# Altium schematic sheet power supply.SchDoc
size A
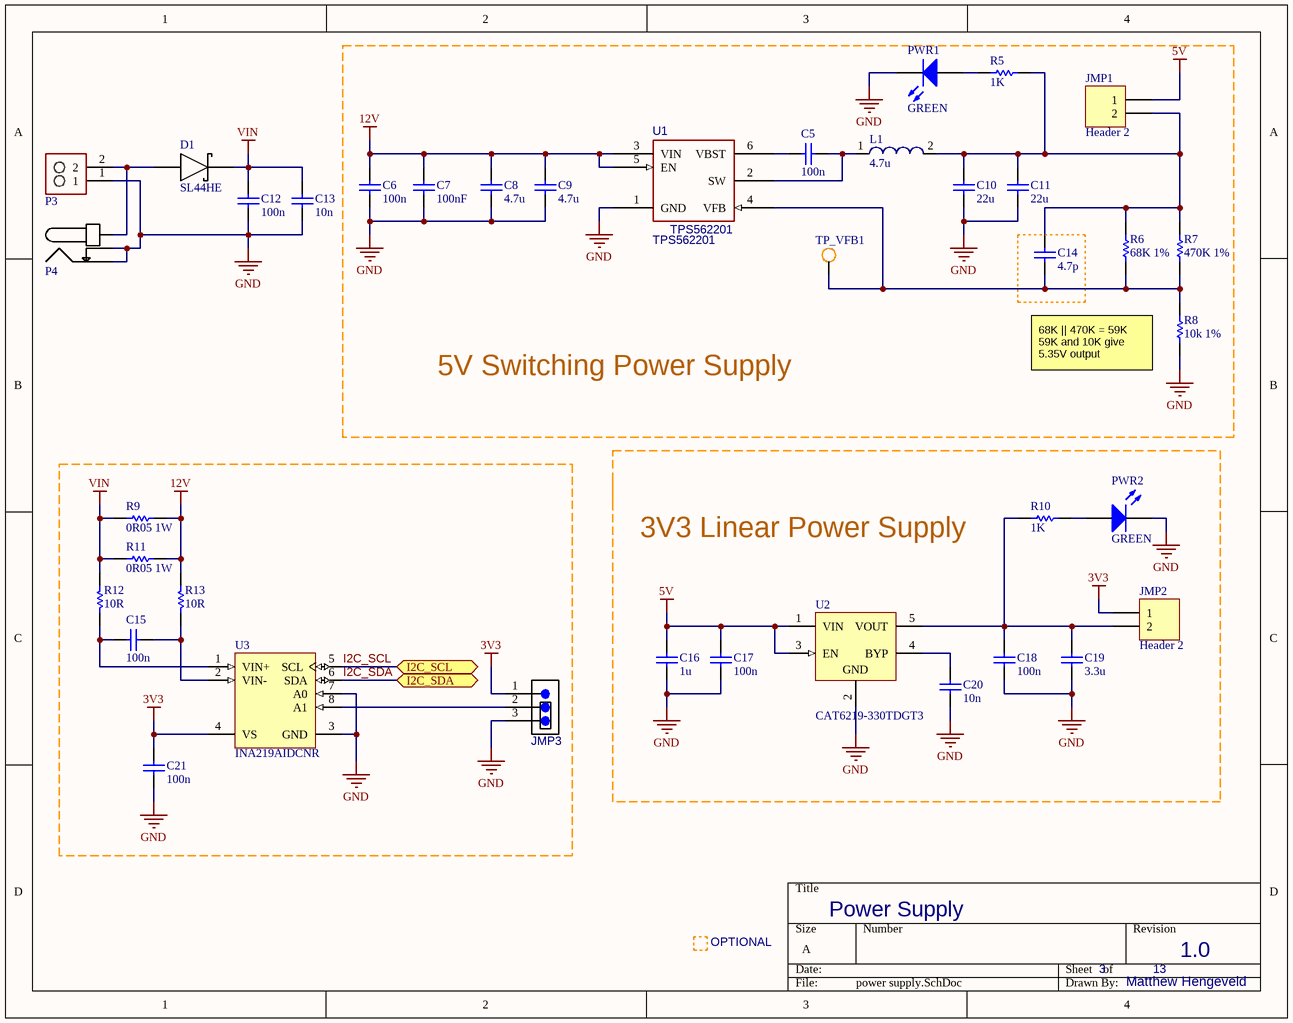
[diagram p0: power supply.SchDoc]

## Parts
C5  100n  [CAPC2113X100X50LL30T25]
C6  100n  [CAPC1608X90X35LL15T15]
C7  100nF  [CAPC2013X94X50LL20T25]
C8  4.7u  [CAPC3225X220X20ML40]
C9  4.7u  [CAPC3225X220X20ML40]
C10  22u  [CAPC3225X220X20ML40]
C11  22u  [CAPC3225X220X20ML40]
C12  100n  [CAPC2013X95X45LL15T25]
C13  10n  [CAPC2013X95X45LL15T25]
C14  4.7p  [CAPC1608X87X35LL15T15]
C15  100n  [CAPC1608X87X35LL15T15]
C16  1u  [CAPC2013X140X50LL20T25]
C17  100n  [CAPC1608X87X35LL15T15]
C18  100n  [CAPC1608X87X35LL15T15]
C19  3.3u  [CAPC3225X220X20ML40]
C20  10n  [CAPC1608X87X35LL15T15]
C21  100n  [CAPC1608X87X35LL15T15]
D1  SL44HE  [SMC Diode]
JMP1  Header 2  [HDR1X2]
JMP2  Header 2  [HDR1X2]
JMP3  SMD_JMP  [0603_JUMPER]  (value not drawn)
L1  4.7u  [WE-LQS 6045]
P3  2PIN_SCREW_TERM_3_5MM  [2PIN_SCREWW_TERM_3_5MM]  (value not drawn)
P4  Barrel Jack  [2.1x5.5mm Barrel Jack - Holes]  (value not drawn)
PWR1  GREEN  [0805_A]
PWR2  GREEN  [0805_A]
R5  1K  [RESC1608X55X30LL15T15]
R6  68K 1%  [RESC1608X55X30LL15T15]
R7  470K 1%  [RESC1608X55X30LL15T15]
R8  10k 1%  [RESC1608X55X30LL15T15]
R9  0R05 1W  [ROHM-MCR100-2_V]
R10  1K  [RESC1608X55X30LL15T15]
R11  0R05 1W  [ROHM-MCR100-2_V]
R12  10R  [RESC1608X55X30LL15T15]
R13  10R  [RESC1608X55X30LL15T15]
TP_VFB1  Test point  [SMD Test Hook]  (value not drawn)
U1  TPS562201  [MCHP-SOT-23-OT6_N]
U2  CAT6219-330TDGT3  [SOT-23-5]
U3  INA219AIDCNR  [SOT-23-8]

## Blocks framed on the sheet
5V Switching Power Supply: C5-C11 C14 JMP1 L1 PWR1 R5-R8 TP_VFB1 U1

## Ports
I2C_SCL (bidir), I2C_SDA (bidir)

## Nets
3V3: C21.2 JMP2.1 JMP3.1 U3.4(VS)
5V: C16.2 C17.2 JMP1.1 U2.1(VIN) U2.3(EN)
12V: C6.2 C7.1 C8.2 C9.2 R9.2 R11.2 R13.1 U1.3(VIN) U1.5(EN)
GND: C6.1 C7.2 C8.1 C9.1 C10.1 C11.1 C12.1 C13.1 C16.1 C17.1 C18.1 C19.1 C20.1 C21.1 JMP3.3 P3.1 P4.2 P4.3 PWR1.1(K) PWR2.1(K) R8.1 U1.1(GND) U2.2(GND) U3.3(GND) U3.7(A0)
VIN: C12.2 C13.2 D1.1(K) R9.1 R11.1 R12.1
I2C_SCL: U3.5(SCL) ; port I2C_SCL
I2C_SDA: U3.6(SDA) ; port I2C_SDA
NetC5_1: C5.1 U1.6(VBST)
NetC5_2: C5.2 L1.1 U1.2(SW)
NetC10_2: C10.2 C11.2 C14.2 JMP1.2 L1.2 R5.1 R6.2 R7.2
NetC14_1: C14.1 R6.1 R7.1 R8.2 TP_VFB1.1(point) U1.4(VFB)
NetC15_1: C15.1 R12.2 U3.1(VIN+)
NetC15_2: C15.2 R13.2 U3.2(VIN-)
NetC18_2: C18.2 C19.2 JMP2.2 R10.2 U2.5(VOUT)
NetC20_2: C20.2 U2.4(BYP)
NetD1_2: D1.2(A) P3.2 P4.1
NetJMP3_2: JMP3.2 U3.8(A1)
NetPWR1_2: PWR1.2(A) R5.2
NetPWR2_2: PWR2.2(A) R10.1

## Notes on the sheet
- (near R8) 68K || 470K = 59K
  59K and 10K give 5.35V output
- 3V3 Linear Power Supply
- OPTIONAL
- Power Supply
- 3
- 13
- 1.0
- Matthew Hengeveld

## Library data of the parts
C5 = CMP-2007-00009-1: Manufacturer: Kemet; Part Number: C0805X104K5RACTU
C6 = CMP-2006-04389-2: Chip Capacitor, 100 nF, +/- 10%, 50 V, -55 to 125 degC, 0603 (1608 Metric), RoHS, Tape and Reel; Case\Package: 0603; Type (Capacitors): X7R; Capacitance: 100 nF; Voltage Rating: 50 V; Pins: 2; Max Operating Temperature: 125 degC; Min Operating Temperature: -55 degC; Case Code (Imperial): 0603; DatasheetVersion: 07/2016; Package Quantity: 4000; Length: 1.6 mm; REACH SVHC: No SVHC; Packaging: Tape and Reel; Case Code (Metric): 1608; Mounting Technology: Surface Mount; RoHSCompliant: true; Height: 0.9 mm; ComponentLink1URL: http://www.avx.com/; ComponentLink2URL: http://datasheets.avx.com/X7RDielectric.pdf; Mount: Surface Mount; ComponentLink2Description: Datasheet; Width: 0.81 mm; PackageReference: 0603; PackageDescription: 2-Pin Surface Mount Device, Body 1.6 x 0.81 mm; Radiation Hardening: No; ComponentLink1Description: Manufacturer URL; Voltage Rating (DC): 50 V; Tolerance: 10%
C7 = CMP-2007-04370-1: Part Number: 08055C104K4T2A; Manufacturer: AVX Interconnect / Elco
C8-C11 C19 = CMP-2000-06054-1: Chip Capacitor, 4.7 uF, +/- 20%, 100 V, -55 to 125 degC, 1210 (3225 Metric), RoHS, Tape and Reel; PCN Part Number: MLCCPartNumberChange30/Nov/2012; Manufacturer: TDK; Online Catalog: CSeries,MidVoltage; Featured Product: MidVoltageX7S-100VMLCCsC-SeriesMidVoltageMLCCs; Capacitance: 4.7µF; Temperature Coefficient: X7S; Voltage - Rated: 100V; Product Training Modules: SEAT,CCV,andTVCLDesignToolsCSeriesMidVoltageCapacitorsFamilyGuidetoReplacinganElectrolyticCapacitorwithanMLCC; Other Names: 445-6043-6; Catalog Drawings: CSERIES_1210_2.2; Datasheet Version: 03/2015; Package Reference: 3225; Category: Capacitors; RoHS Information: RoHSCertificate-MLCC; Packaging: Digi-Reel®; Lead Spacing: -; Mounting Type: SurfaceMount,MLCC; Family: CeramicCapacitors; Applications: GeneralPurpose; Thickness (Max): 0.087"(2.20mm); Series: C; Height - Seated (Max): -; Datasheet URL: https://product.tdk.com/info/en/catalog/datasheets/mlcc_commercial_midvoltage_en.pdf; Lead Style: -; Features: -; Mounting Technology: SurfaceMount; Package / Case: 1210(3225Metric); Operating Temperature: -55°C~125°C; Manufacturer URL: http://www.tdk.com/; Standard Package: 1; Package Description: 2-Pin Surface Mount Device, Body 3.2 x 2.5 mm; Tolerance: ±20%; Ratings: -; Size / Dimension: 0.126"Lx0.098"W(3.20mmx2.50mm)
C12 C13 = CMP-2007-00072-1: Part Number: GCM2195C1H103JA16D; Manufacturer: Murata
C14 C17 C18 C20 = CMP-2006-03057-1: Manufacturer: Kemet; Part Number: C0603C104K3RACTU
C15 C21 = CMP-2006-03300-1: Part Number: C0603X104K5RACTU; Manufacturer: Kemet
C16 = CMP-2007-04672-1: Part Number: 0805ZC105KAT2A; Manufacturer: AVX Interconnect / Elco
D1 = SL44HE: Schottky Power Rectifier, 2-Pin SMC, 40V, 8A; PartNumber: MBRS540T3; Manufacturer: On Semiconductor; IFSM Max (A): 190; Configuration: Single; Packing: Tape and Reel; ComponentLink1Description: Manufacturer URL; ComponentLink3URL: http://www.onsemi.com/pub_link/Collateral/403-03.PDF; DatasheetVersion: Rev. 8; ComponentLink2Description: Datasheet; PackageReference: SMC-2-403-03; PackageDescription: 2-Pin Small Molded Package, J-Bend Lead, Body 5.845 x 6.855 mm; PackageVersion: Rev. E, 08/2005; ComponentLink1URL: http://www.onsemi.com/; ComponentLink2URL: http://www.onsemi.cn/pub_link/Collateral/MBRS540T3-D.PDF; RoHS: FALSE; ComponentLink3Description: Package Specification; Mounting Technology: Surface Mount
JMP1 JMP2 = Header 2: Header, 2-Pin; LatestRevisionDate: 17-Jul-2002; LatestRevisionNote: Re-released for DXP Platform.; Publisher: Altium Limited
L1 = CMP-1354-00077-1: WE-LQS SMD Power Inductor, L=4.7 µH; Manufacturer: Wuerth Elektronik; PartNumber: 74404064047; Inductance: 4.7 ÂµH; PackageReference: WE-LQS 6045; ComponentLink2URL: http://katalog.we-online.de/pbs/datasheet/74404064047.pdf; ComponentLink1Description: Manufacturer URL; ComponentLink1URL: http://www.we-online.com; ComponentLink2Description: Datasheet
PWR1 PWR2 = CMP-1426-00011-1: SMD mono-color Chip LED, WL-SMCW, Red; PartNumber: 150080RS75000; Manufacturer: Wuerth Elektronik; Color: Red; PackageReference: 0805_A; ComponentLink2Description: Datasheet; ComponentLink1URL: http://www.we-online.com; ComponentLink1Description: Manufacturer URL; ComponentLink2URL: http://katalog.we-online.com/led/datasheet/150080RS75000.pdf
R5-R8 R10 = CMP-2000-00181-1: Part Number: ERJ-3EKF1002V; Manufacturer: Panasonic
R9 R11 = CMP-1238-00003-1: PartNumber: MCR100JZHFLR470; Manufacturer: ROHM Semiconductor; Resistance: 0.47 Ohm; Packing: Tape; Overload Voltage: 6.02 V Max.; Limiting Element Voltage: 3.01 V; Resistance Tolerance: +/-1%; PackageDescription: 2-Pin Chip Resistor, Body 6.3 x 3.2 mm, Height 0.7 mm; Rated Power@70 degC: 1 W; ComponentLink3Description: Package Specification; ComponentLink2Description: Datasheet; DatasheetVersion: Rev. C; ComponentLink2URL: http://rohmfs.rohm.com/en/products/databook/datasheet/passive/resistor/chip_resistor/mcr_low.pdf; Operating Temperature: -55 to 125 degC; ComponentLink3URL: http://rohmfs.rohm.com/en/products/databook/datasheet/passive/resistor/chip_resistor/mcr_low.pdf; ComponentLink1URL: http://www.rohm.com/web/global/; Mounting Technology: Surface Mount; RoHS: TRUE; ComponentLink1Description: Manufacturer URL
R12 R13 = CMP-2000-00704-1: Manufacturer: Panasonic; Part Number: ERJ-3GEYJ103V
U2 = CAT6219: Fixed Low Drop Positive Voltage Regulator, 3.3V, 5-Pin TSOT-23, Tape and Reel; Manufacturer: ON Semiconductor; PSRR (dB): 64; VI Max (V): 5.5; Output: Single; Iq Typ (mA): 0.085; Noise (uVrms): 45; VDO Typ (V): 0.3; Io Typ(A): 0.5; Vo(V): 3.3; Polarity: Positive; DatasheetVersion: Rev. 14; Package Type: TSOT-23-5; RoHS: Pb-free; Mounting Technology: Surface Mount; ComponentLink1URL: http://www.onsemi.com/; PartNumber: CAT6219-330TDGT3; ComponentLink3Description: Package Specification; ComponentLink2URL: http://www.onsemi.com/pub_link/Collateral/CAT6219-D.PDF; ComponentLink3URL: http://www.onsemi.com/pub_link/Collateral/419AE.PDF; PackageVersion: Rev. O; ComponentLink1Description: Manufacturer URL; PackageReference: TSOT-23; ComponentLink2Description: Datasheet; PackageDescription: 5-Pin Plastic Small Outline Package, Body 2.9 x 1.6mm, Pitch 0.95mm
U3 = INA219: Zero-Drift, Bi-directional Current / Power Monitor, 3 to 5.5 V, -40 to 125 degC, 8-pin SOP (DCN8), Green (RoHS & no Sb/Br); Manufacturer: Texas Instruments; Input Offset (+/-)(Max)(uV): 100; Small-Signal Bandwidth(Typ)(MHz): 0.011; SubFamily: Current Shunt Monitor; Rating: Catalog; Quiescent Current (+/-)(Typ)(mA): 0.7; Vs(Max)(V): 5.5; Common Mode Range(Min)(V): 0; Vs(Min)(V): 3; Common Mode Range(Max)(V): 26; Gain(V/V): 1, 0.5, 0.25, 0.125; ComponentLink3URL: http://www.ti.com/lit/ml/mpds099c/mpds099c.pdf; ComponentLink2URL: http://www.ti.com/general/docs/lit/getliterature.tsp?genericPartNumber=INA219&fileType=pdf; PackageReference: DCN0008A; ComponentLink1URL: http://www.ti.com/; ComponentLink1Description: Manufacturer URL; Code_JEDEC: MO-178; CMRR(Min)(dB): 100; DatasheetVersion: SBOS448F; Mounting Technology: Surface Mount; ComponentLink3Description: Package Specification; PartNumber: INA219AIDCNR; PackageVersion: 4202106/D, 11/2009; Eco-Plan: Green (RoHS & no Sb/Br); ComponentLink2Description: Datasheet; PackageDescription: 8-Pin Plastic Small Outline, Body 1.6 x 2.9 mm, Pitch 0.65 mm